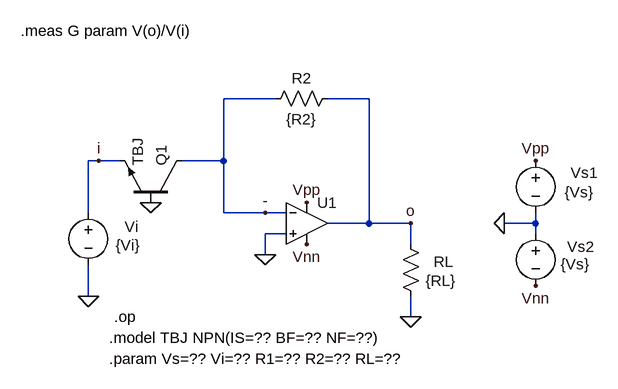
[diagram p0: schematic OPAMPTBJ03Fig.asc]
OPAMPTBJ03Fig.asc, the LTspice schematic file:
Version 4
SHEET 1 968 680
WIRE 112 32 32 32
WIRE 256 32 192 32
WIRE -160 128 -176 128
WIRE -128 128 -160 128
WIRE 32 128 32 32
WIRE 32 128 -32 128
WIRE -176 208 -176 128
WIRE 32 208 32 128
WIRE 96 208 32 208
WIRE 128 208 96 208
WIRE 256 224 256 32
WIRE 256 224 192 224
WIRE 320 224 256 224
WIRE 512 224 512 208
WIRE 512 224 464 224
WIRE 128 240 96 240
WIRE 512 240 512 224
WIRE 320 256 320 224
WIRE 96 272 96 240
WIRE -176 336 -176 288
WIRE 320 368 320 336
FLAG 512 128 Vpp
FLAG 464 224 0
FLAG 512 320 Vnn
FLAG 320 368 0
FLAG -176 336 0
FLAG 160 192 Vpp
FLAG 160 256 Vnn
FLAG 96 272 0
FLAG 320 224 o
FLAG -160 128 i
FLAG 96 208 -
FLAG -80 192 0
SYMBOL voltage 512 112 R0
WINDOW 123 0 0 Left 0
WINDOW 39 0 0 Left 0
WINDOW 0 54 34 Left 2
WINDOW 3 45 64 Left 2
SYMATTR InstName Vs1
SYMATTR Value {Vs}
SYMBOL voltage 512 224 R0
WINDOW 123 0 0 Left 0
WINDOW 39 0 0 Left 0
WINDOW 0 49 36 Left 2
WINDOW 3 39 63 Left 2
SYMATTR InstName Vs2
SYMATTR Value {Vs}
SYMBOL res 304 240 R0
WINDOW 0 51 43 Left 2
WINDOW 3 39 72 Left 2
SYMATTR InstName RL
SYMATTR Value {RL}
SYMBOL voltage -176 192 R0
WINDOW 3 42 66 Left 2
WINDOW 123 0 0 Left 0
WINDOW 39 0 0 Left 0
WINDOW 0 56 37 Left 2
SYMATTR Value {Vi}
SYMATTR InstName Vi
SYMBOL Opamps\\UniversalOpamp2 160 224 R0
SYMATTR InstName U1
SYMBOL res 208 16 R90
WINDOW 0 0 56 VBottom 2
WINDOW 3 32 56 VTop 2
SYMATTR InstName R2
SYMATTR Value {R2}
SYMBOL npn -32 192 M270
SYMATTR InstName Q1
SYMATTR Value TBJ
TEXT -144 432 Left 2 !.param Vs=?? Vi=?? R1=?? R2=?? RL=??
TEXT -136 368 Left 2 !.op
TEXT -280 -72 Left 2 !.meas G param V(o)/V(i)
TEXT -144 400 Left 2 !.model TBJ NPN(IS=?? BF=?? NF=??)

The netlist it stands for:
* OPAMPTBJ03Fig.asc
Vs1 Vpp 0 {Vs}
Vs2 0 Vnn {Vs}
RL o 0 {RL}
Vi i 0 {Vi}
XU1 0 - Vpp Vnn o level.2 Avol=1Meg GBW=10Meg Slew=10Meg ilimit=25m rail=0 Vos=0 phimargin=45 en=0 enk=0 in=0 ink=0 Rin=500Meg  ; pins IN+ IN- V+ V- OUT
R2 o - {R2}
Q1 - 0 i 0 TBJ
.model NPN NPN
.model PNP PNP
.lib standard.bjt
.param Vs=?? Vi=?? R1=?? R2=?? RL=??
.op
.meas G param V(o)/V(i)
.model TBJ NPN(IS=?? BF=?? NF=??)
.lib UniversalOpamps2.sub
.backanno
.end